# EAGLE design Mega Stepper Shield Integrated (EAGLE 9.6.2)

## Sheet 1 of 2
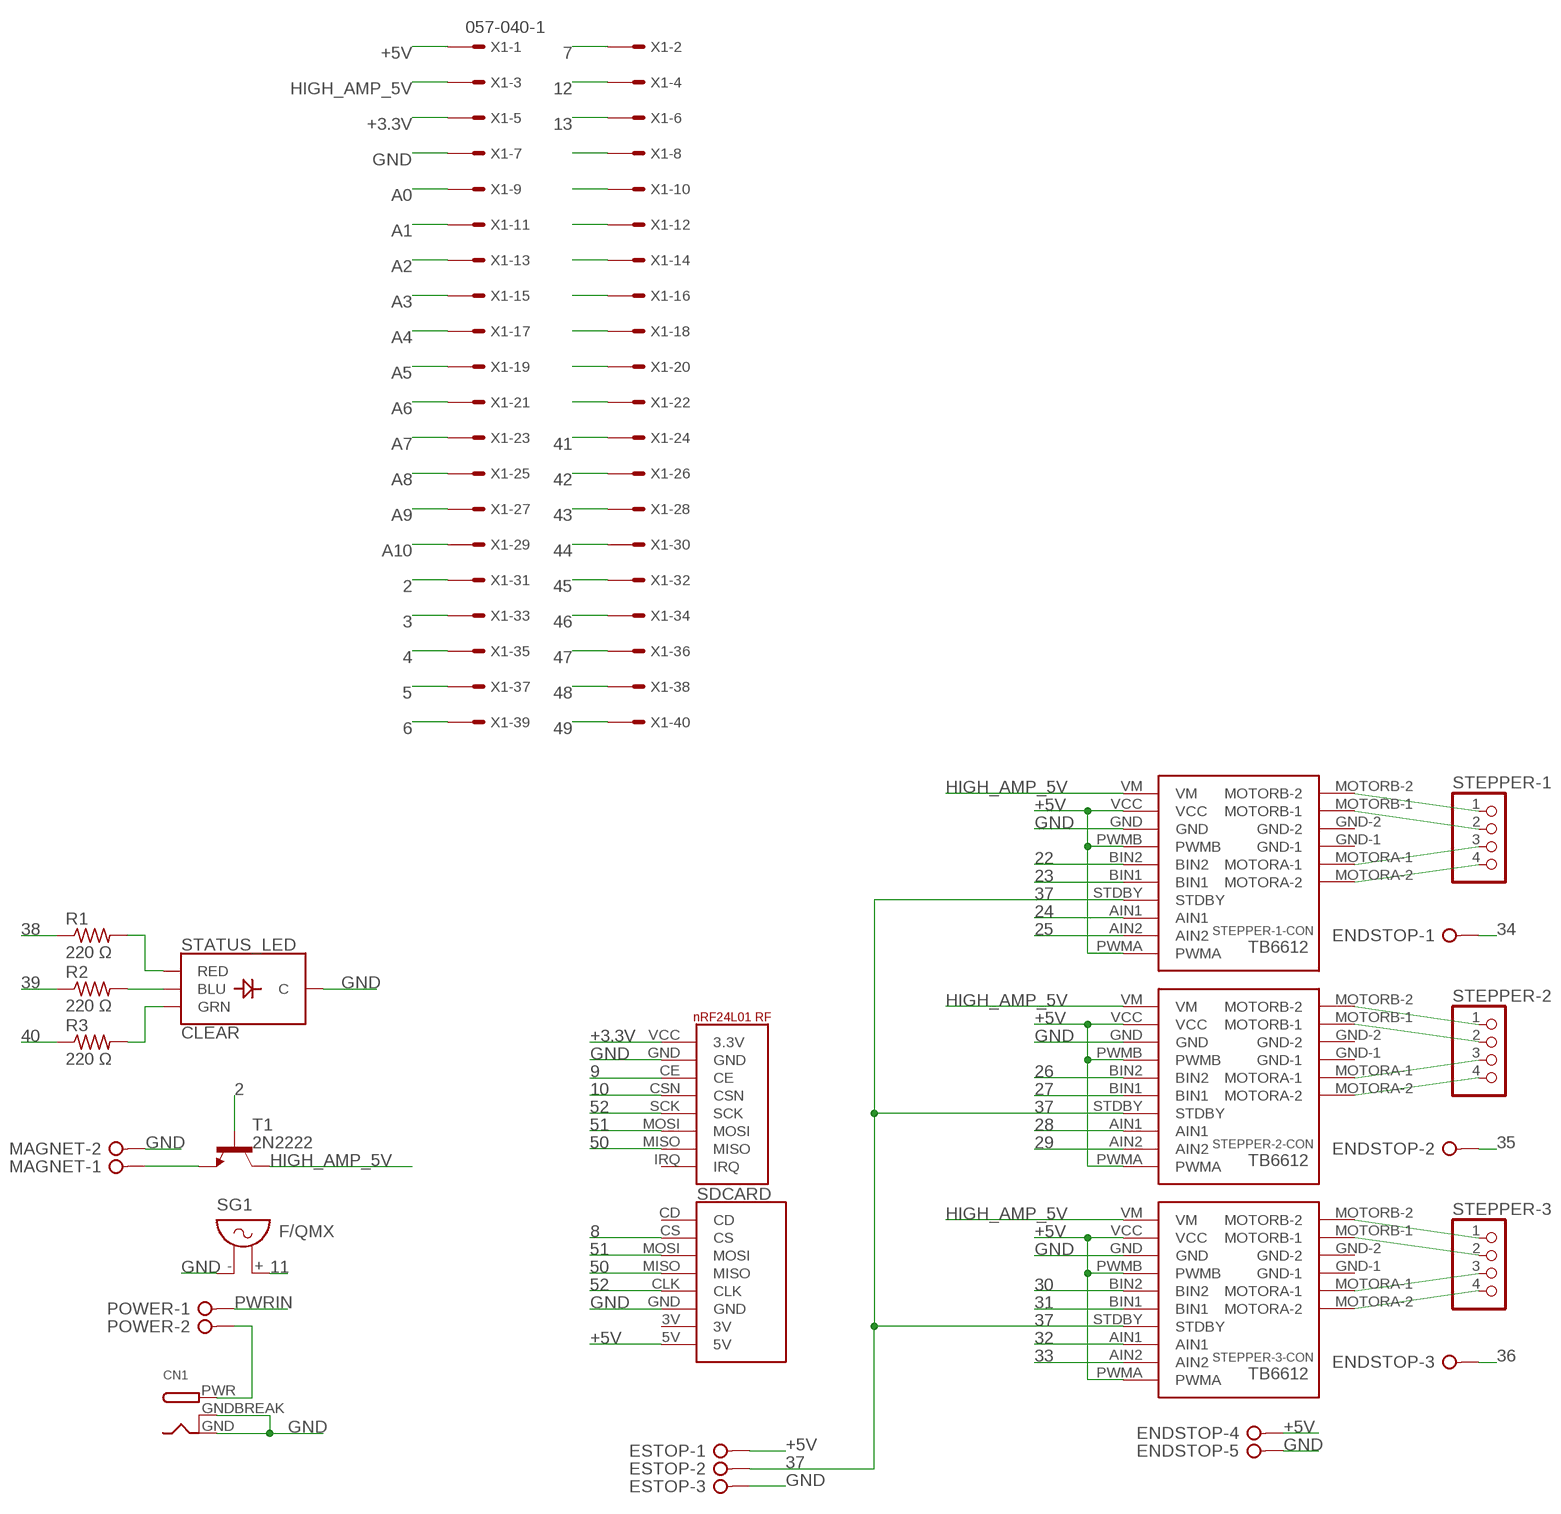
[diagram p0: schematic, sheet 1]

### Parts
CN1  DCBARRELPTH  [DCJACK_2MM_PTH]
ENDSTOP  W237-05P  [W237-5P]
ESTOP  W237-3E  [W237-3E]
MAGNET  W237-02P  [W237-132]
POWER  W237-02P  [W237-132]
R1  220 Ω  R-US_0204/7  [0204/7]
R2  220 Ω  R-US_0204/7  [0204/7]
R3  220 Ω  R-US_0204/7  [0204/7]
SDCARD  MICRO_SD_BREAKOUT  [MICROSDCARDBREAKOUT]
SG1  F/QMX  [F/QMX]
STATUS_LED  CLEAR  LED-RGB-CCCLEAR  [LED-RGB-THRU]
STEPPER-1  PINHD-1X4  [1X04]
STEPPER-1-CON  TB6612-BREAKOUT-MOTOR-CONTROLLER  [TB6612-HEADERS]
STEPPER-2  PINHD-1X4  [1X04]
STEPPER-2-CON  TB6612-BREAKOUT-MOTOR-CONTROLLER  [TB6612-HEADERS]
STEPPER-3  PINHD-1X4  [1X04]
STEPPER-3-CON  TB6612-BREAKOUT-MOTOR-CONTROLLER  [TB6612-HEADERS]
T1  2N2222  [TO92-EBC-OVAL]
U$1  NRF24L01_RF_MODULE  [NRF24L01RF]
X1  057-040-1  [057-040-1]

### Nets
2: T1.B X1.31 ; also sheet 2
3: X1.33 ; also sheet 2
4: X1.35 ; also sheet 2
5: X1.37 ; also sheet 2
6: X1.39 ; also sheet 2
7: X1.2 ; also sheet 2
8: SDCARD.CS ; also sheet 2
9: U$1.CE ; also sheet 2
10: U$1.CSN ; also sheet 2
11: SG1.+ ; also sheet 2
12: X1.4 ; also sheet 2
13: X1.6 ; also sheet 2
16: X1.8
22: STEPPER-1-CON.BIN2 ; also sheet 2
23: STEPPER-1-CON.BIN1 ; also sheet 2
24: STEPPER-1-CON.AIN1 ; also sheet 2
25: STEPPER-1-CON.AIN2 ; also sheet 2
26: STEPPER-2-CON.BIN2 ; also sheet 2
27: STEPPER-2-CON.BIN1 ; also sheet 2
28: STEPPER-2-CON.AIN1 ; also sheet 2
29: STEPPER-2-CON.AIN2 ; also sheet 2
30: STEPPER-3-CON.BIN2 ; also sheet 2
31: STEPPER-3-CON.BIN1 ; also sheet 2
32: STEPPER-3-CON.AIN1 ; also sheet 2
33: STEPPER-3-CON.AIN2 ; also sheet 2
34: ENDSTOP.1 ; also sheet 2
35: ENDSTOP.2 ; also sheet 2
36: ENDSTOP.3 ; also sheet 2
37: ESTOP.2 STEPPER-1-CON.STDBY STEPPER-2-CON.STDBY STEPPER-3-CON.STDBY ; also sheet 2
38: R1.1 ; also sheet 2
39: R2.1 ; also sheet 2
40: R3.1 X1.22 ; also sheet 2
41: X1.24 ; also sheet 2
42: X1.26 ; also sheet 2
43: X1.28 ; also sheet 2
44: X1.30 ; also sheet 2
45: X1.32 ; also sheet 2
46: X1.34 ; also sheet 2
47: X1.36 ; also sheet 2
48: X1.38 ; also sheet 2
49: X1.40 ; also sheet 2
50: SDCARD.MISO U$1.MISO ; also sheet 2
51: SDCARD.MOSI U$1.MOSI ; also sheet 2
52: SDCARD.CLK U$1.SCK ; also sheet 2
+3.3V [Power]: U$1.VCC(3.3V) X1.5
+5V: ENDSTOP.4 ESTOP.1 SDCARD.5V STEPPER-1-CON.PWMA STEPPER-1-CON.PWMB STEPPER-1-CON.VCC STEPPER-2-CON.PWMA STEPPER-2-CON.PWMB STEPPER-2-CON.VCC STEPPER-3-CON.PWMA STEPPER-3-CON.PWMB STEPPER-3-CON.VCC X1.1 ; also sheet 2
A0: X1.9 ; also sheet 2
A1: X1.11 ; also sheet 2
A2: X1.13 ; also sheet 2
A3: X1.15 ; also sheet 2
A4: X1.17 ; also sheet 2
A5: X1.19 ; also sheet 2
A6: X1.21 ; also sheet 2
A7: X1.23 ; also sheet 2
A8: X1.25 ; also sheet 2
A9: X1.27 ; also sheet 2
A10: X1.29 ; also sheet 2
GND [Power]: CN1.GND CN1.GNDBREAK ENDSTOP.5 ESTOP.3 MAGNET.2 SDCARD.GND SG1.- STATUS_LED.2(C) STEPPER-1-CON.GND STEPPER-2-CON.GND STEPPER-3-CON.GND U$1.GND X1.7 ; also sheet 2
HIGH_AMP_5V [Power]: STEPPER-1-CON.VM STEPPER-2-CON.VM STEPPER-3-CON.VM T1.C X1.3 ; also sheet 2
N$11 [Power]: CN1.PWR POWER.2
N$15 [Stepper Output]: STEPPER-1-CON.MOTORB-2 STEPPER-1.1
N$16 [Stepper Output]: STEPPER-1-CON.MOTORB-1 STEPPER-1.2
N$17 [Stepper Output]: STEPPER-1-CON.MOTORA-1 STEPPER-1.3
N$18 [Stepper Output]: STEPPER-1-CON.MOTORA-2 STEPPER-1.4
N$19 [Stepper Output]: STEPPER-2-CON.MOTORB-2 STEPPER-2.1
N$20 [Stepper Output]: STEPPER-2-CON.MOTORB-1 STEPPER-2.2
N$21 [Stepper Output]: STEPPER-2-CON.MOTORA-1 STEPPER-2.3
N$22 [Stepper Output]: STEPPER-2-CON.MOTORA-2 STEPPER-2.4
N$23 [Stepper Output]: STEPPER-3-CON.MOTORB-2 STEPPER-3.1
N$24 [Stepper Output]: STEPPER-3-CON.MOTORB-1 STEPPER-3.2
N$25 [Stepper Output]: STEPPER-3-CON.MOTORA-1 STEPPER-3.3
N$26 [Stepper Output]: STEPPER-3-CON.MOTORA-2 STEPPER-3.4
N$28: R3.2 STATUS_LED.3(GRN)
N$29: R2.2 STATUS_LED.4(BLU)
N$30: R1.2 STATUS_LED.1(RED)
N$42 [Power]: MAGNET.1 T1.E
N$44: X1.10
N$45: X1.12
N$46: X1.14
N$47: X1.16
N$48: X1.18
N$49: X1.20
PWRIN [Power]: POWER.1 ; also sheet 2
Unconnected: SDCARD.3V SDCARD.CD STEPPER-1-CON.GND-1 STEPPER-1-CON.GND-2 STEPPER-2-CON.GND-1 STEPPER-2-CON.GND-2 STEPPER-3-CON.GND-1 STEPPER-3-CON.GND-2 U$1.IRQ

## Sheet 2 of 2
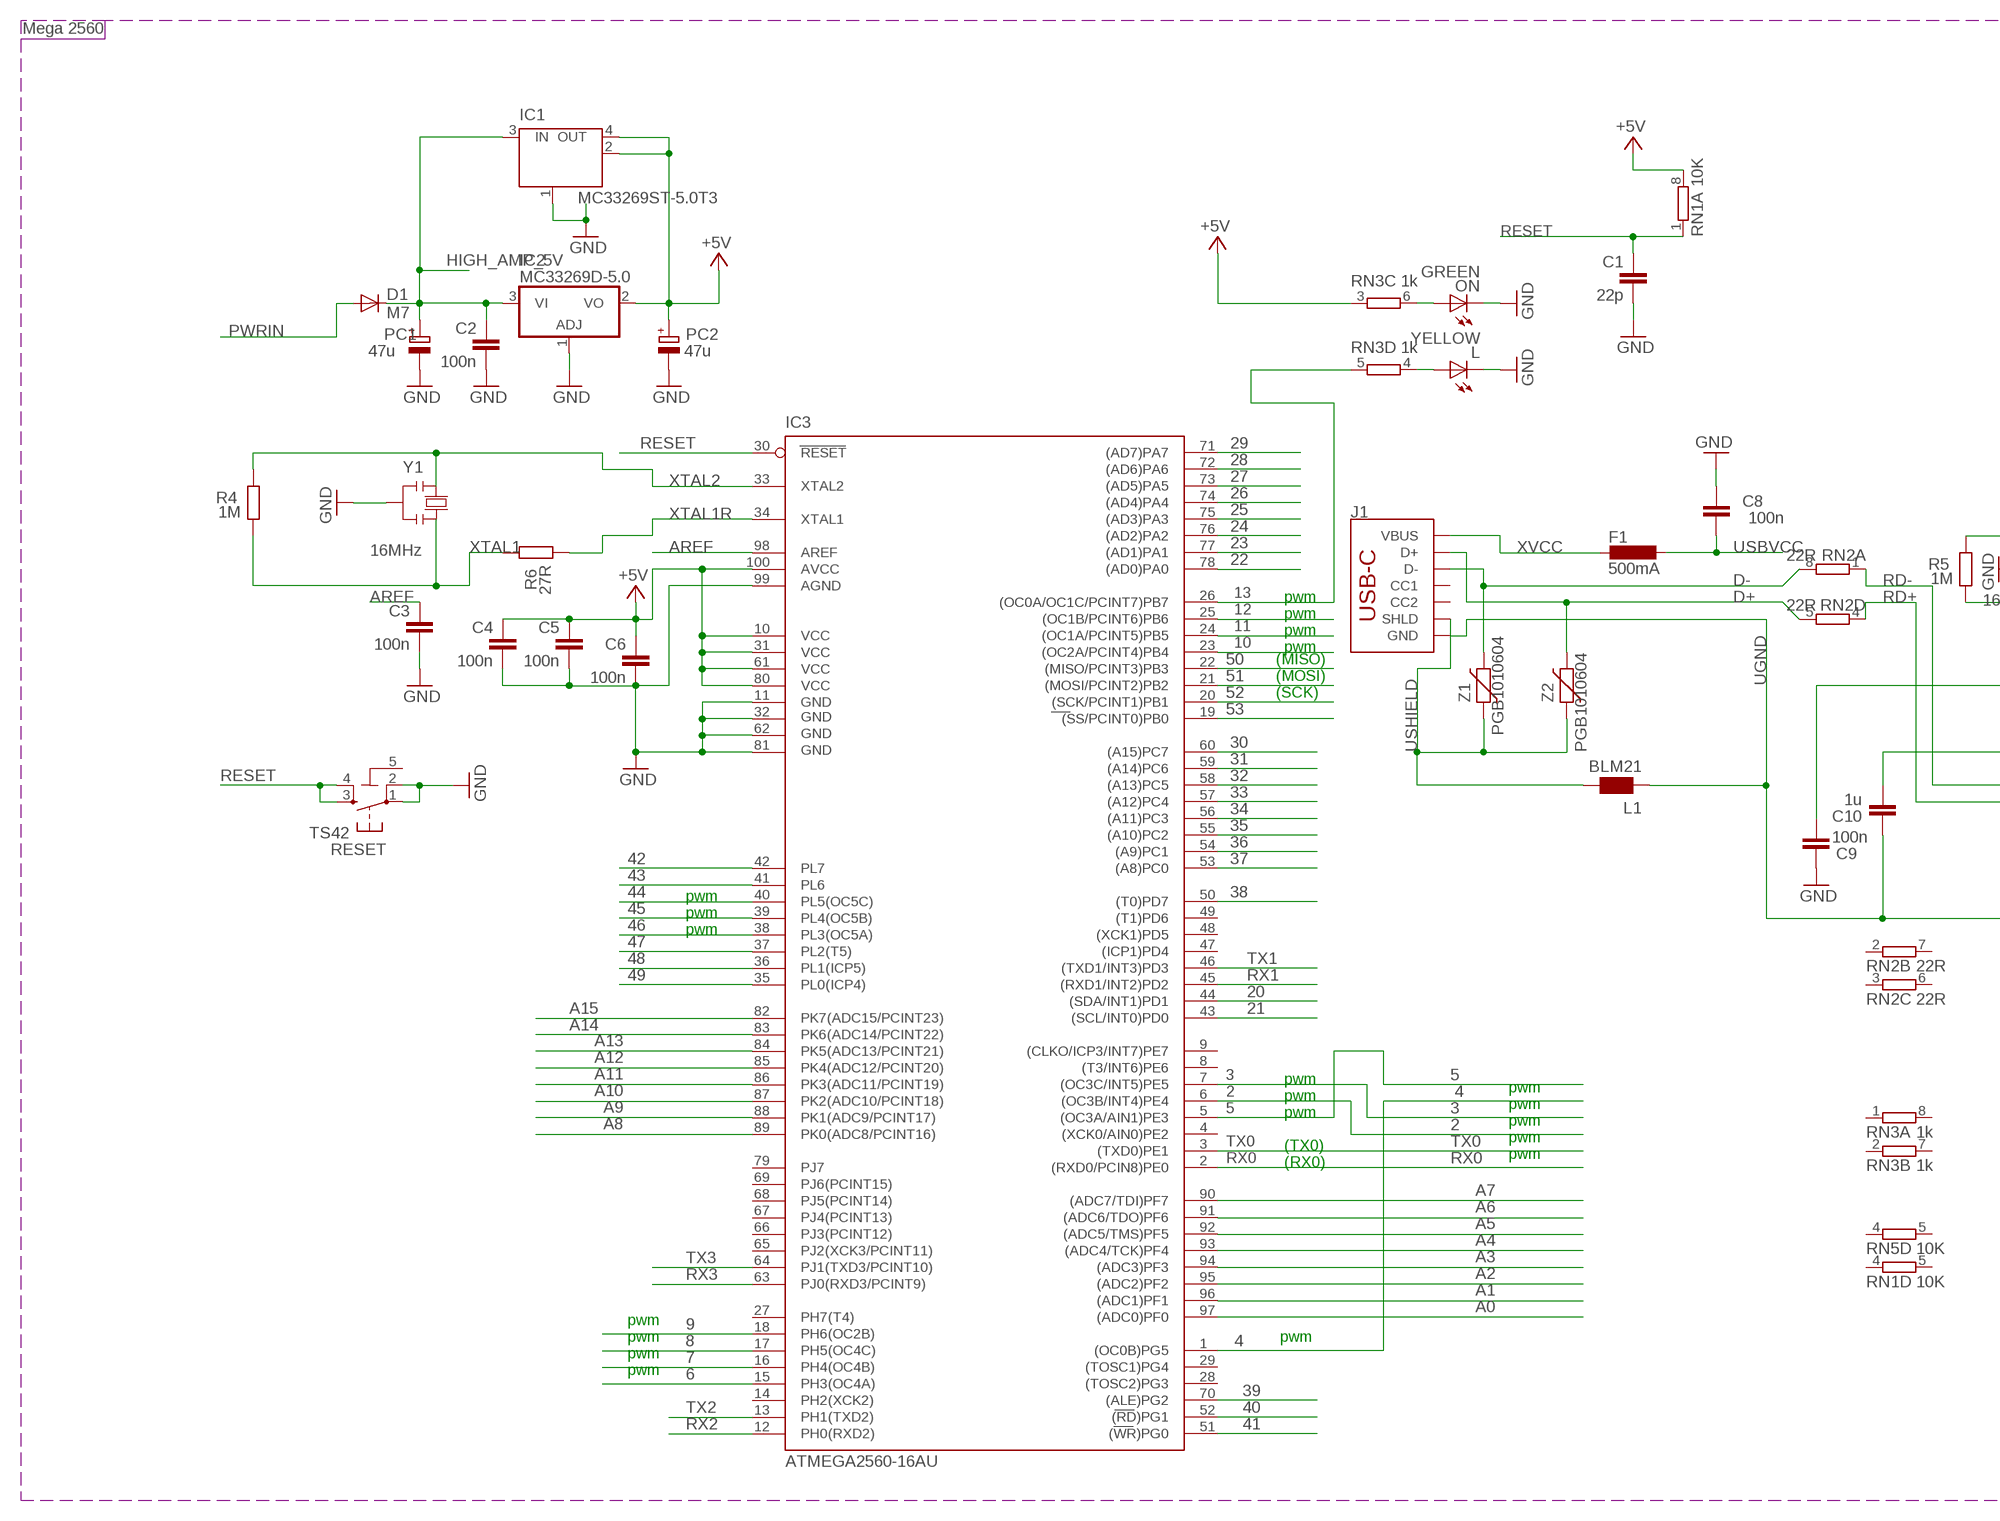
[diagram p1: schematic, sheet 2, part 1 of 2]
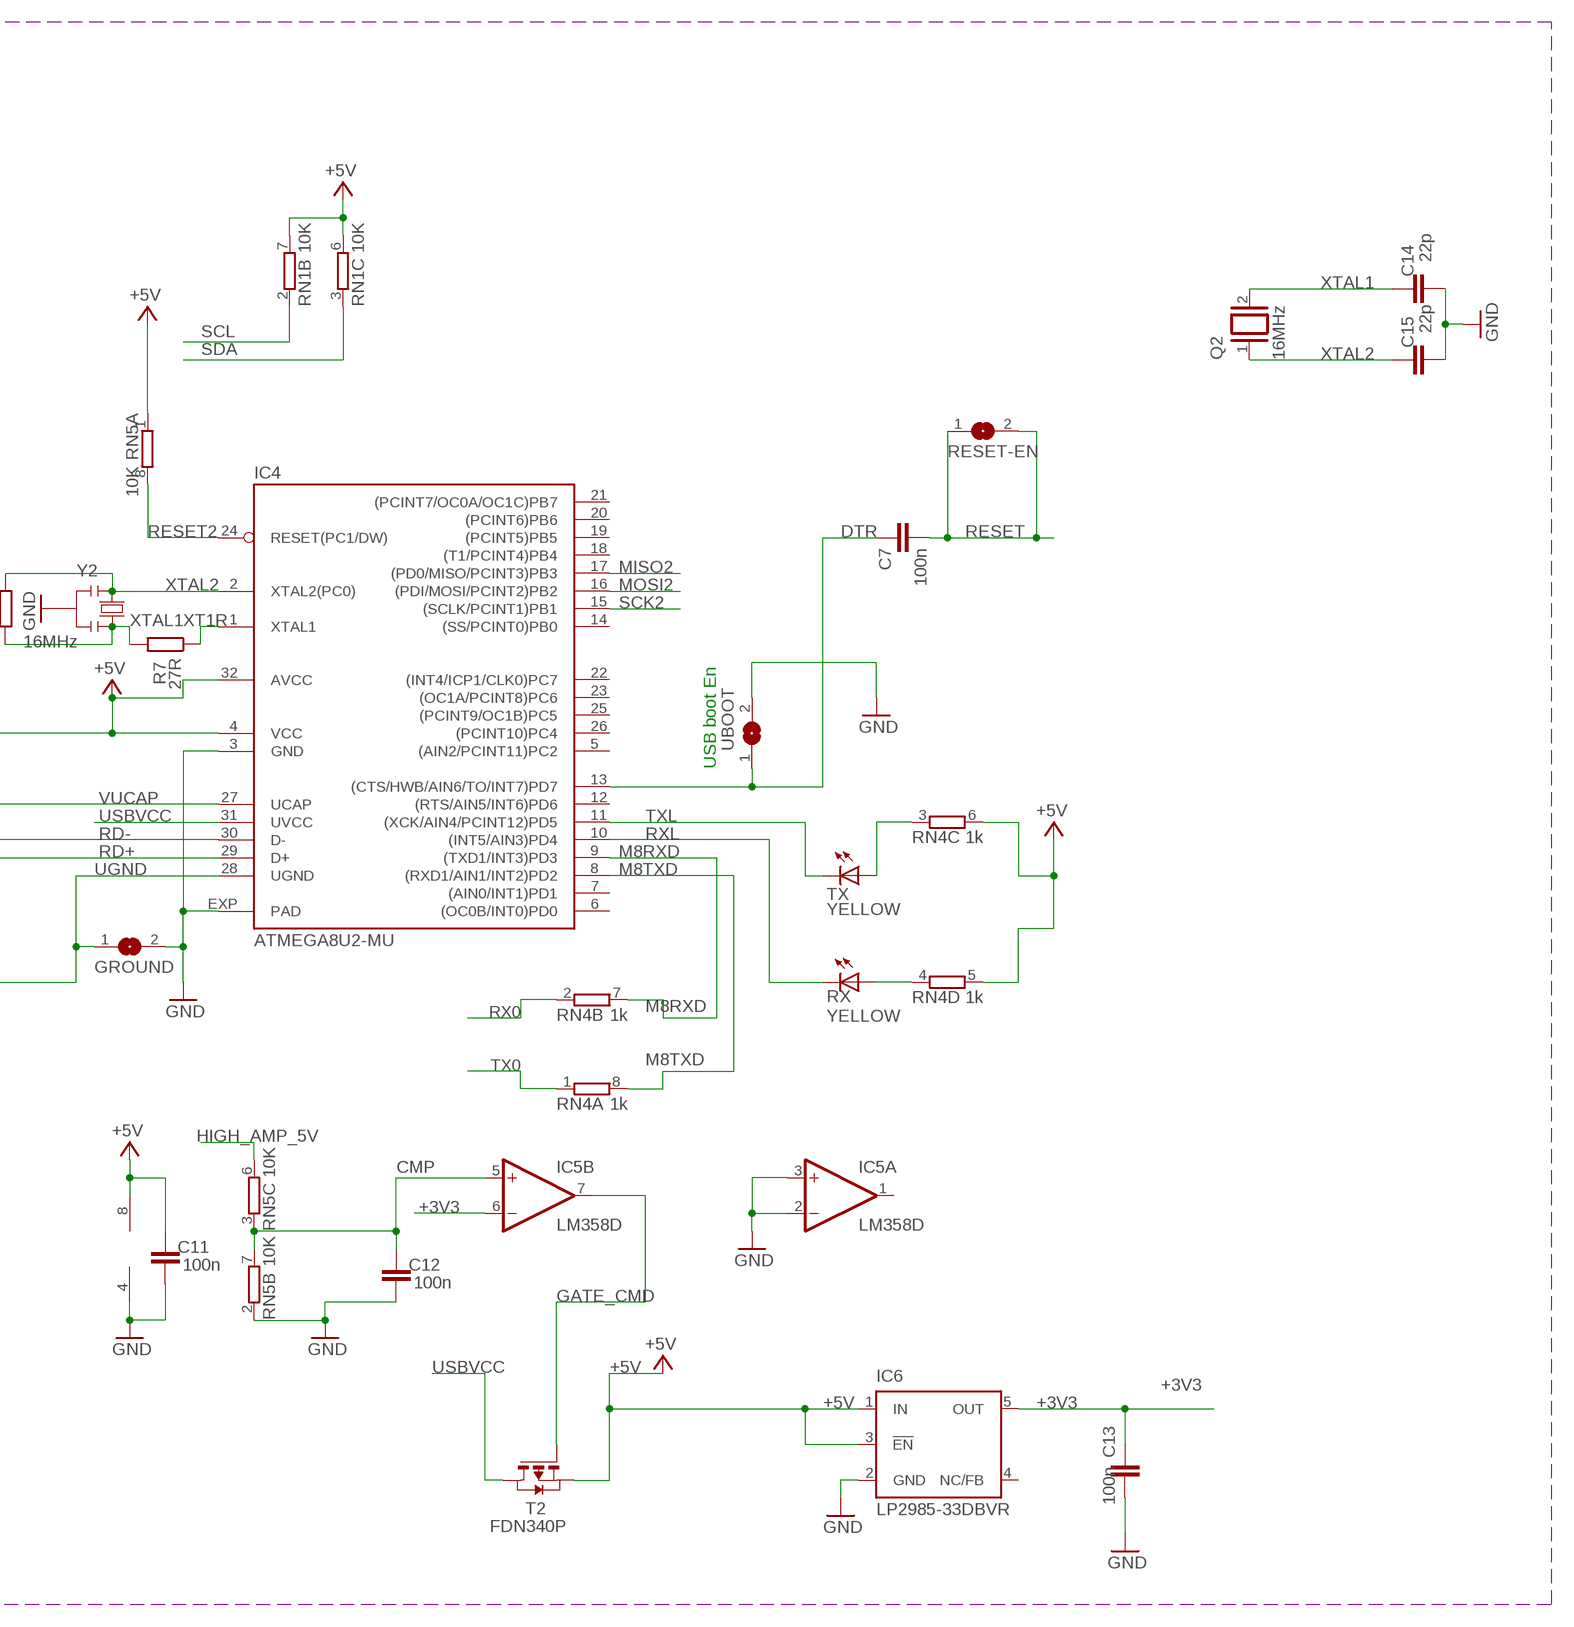
[diagram p2: schematic, sheet 2, part 2 of 2]

### Parts
C1  22p  C-EU0603-RND  [C0603-ROUND]
C2  100n  C-EU0603-RND  [C0603-ROUND]
C3  100n  C-EU0603-RND  [C0603-ROUND]
C4  100n  C-EU0603-RND  [C0603-ROUND]
C5  100n  C-EU0603-RND  [C0603-ROUND]
C6  100n  C-EU0603-RND  [C0603-ROUND]
C7  100n  C-EU0603-RND  [C0603-ROUND]
C8  100n  C-EUC0603  [C0603]
C9  100n  C-EU0603-RND  [C0603-ROUND]
C10  1u  C-EU0603-RND  [C0603-ROUND]
C11  100n  C-EUC0603  [C0603]
C12  100n  C-EU0603-RND  [C0603-ROUND]
C13  100n  C-EU0603-RND  [C0603-ROUND]
C14  22p  C-EU0603-RND  [C0603-ROUND]
C15  22p  C-EU0603-RND  [C0603-ROUND]
D1  M7  DIODE-SMB  [SMB]
F1  500mA  L-EUL1812  [L1812]
GROUND  SJ  [SJ]
IC1  MC33269ST-5.0T3  MC33269ST-3.3T3  [SOT223]
IC2  MC33269D-5.0  [DPACK]
IC3  ATMEGA2560-16AU  ATMEGA1280-16AU  [TQFP100]
IC4  ATMEGA8U2-MU  [QFN32]
IC5  LM358D  [SO08]
IC6  LP2985-33DBVR  TPS77033  [SOT23-DBV]
J1  USB_C_2-LAYER_PADS  [USB-C-16P-2LAYER-PADS]
L  YELLOW  LEDCHIP-LED0805  [CHIP-LED0805]
L1  BLM21  WE-CBF_0805  [0805]
ON  GREEN  LEDCHIP-LED0805  [CHIP-LED0805]
PC1  47u  CPOL-EUD  [PANASONIC_D]
PC2  47u  CPOL-EUD  [PANASONIC_D]
Q2  16MHz  XTAL/S  [QS]
R4  1M  R-EU_R0603  [R0603-ROUND]
R5  1M  R-EU_R0603  [R0603-ROUND]
R6  27R  R-EU_R0603  [R0603-ROUND]
R7  27R  R-EU_R0603  [R0603-ROUND]
RESET  TS42  [TS42]
RESET-EN  SJ  [SJ]
RN1  10K  4R-NCAT16  [CAT16]
RN2  22R  4R-NCAY16  [CAY16]
RN3  1k  4R-NCAY16  [CAY16]
RN4  1k  4R-NCAY16  [CAY16]
RN5  10K  4R-NCAT16  [CAT16]
RX  YELLOW  LEDCHIP-LED0805  [CHIP-LED0805]
T2  FDN340P  PMOSSOT23  [SOT-23]
TX  YELLOW  LEDCHIP-LED0805  [CHIP-LED0805]
UBOOT  SJ  [SJ]
Y1  16MHz  RESONATORMU  [RESONATOR]
Y2  16MHz  RESONATORMU  [RESONATOR]
Z1  PGB1010604  VARISTORCN0603  [CT/CN0603]
Z2  PGB1010604  VARISTORCN0603  [CT/CN0603]

### Nets
2: IC3.6((OC3B/INT4)PE4) ; also sheet 1
3: IC3.7((OC3C/INT5)PE5) ; also sheet 1
4: IC3.1((OC0B)PG5) ; also sheet 1
5: IC3.5((OC3A/AIN1)PE3) ; also sheet 1
6: IC3.15(PH3(OC4A)) ; also sheet 1
7: IC3.16(PH4(OC4B)) ; also sheet 1
8: IC3.17(PH5(OC4C)) ; also sheet 1
9: IC3.18(PH6(OC2B)) ; also sheet 1
10: IC3.23((OC2A/PCINT4)PB4) ; also sheet 1
11: IC3.24((OC1A/PCINT5)PB5) ; also sheet 1
12: IC3.25((OC1B/PCINT6)PB6) ; also sheet 1
13: IC3.26((OC0A/OC1C/PCINT7)PB7) RN3.5 ; also sheet 1
20: IC3.44((SDA/INT1)PD1)
21: IC3.43((SCL/INT0)PD0)
22: IC3.78((AD0)PA0) ; also sheet 1
23: IC3.77((AD1)PA1) ; also sheet 1
24: IC3.76((AD2)PA2) ; also sheet 1
25: IC3.75((AD3)PA3) ; also sheet 1
26: IC3.74((AD4)PA4) ; also sheet 1
27: IC3.73((AD5)PA5) ; also sheet 1
28: IC3.72((AD6)PA6) ; also sheet 1
29: IC3.71((AD7)PA7) ; also sheet 1
30: IC3.60((A15)PC7) ; also sheet 1
31: IC3.59((A14)PC6) ; also sheet 1
32: IC3.58((A13)PC5) ; also sheet 1
33: IC3.57((A12)PC4) ; also sheet 1
34: IC3.56((A11)PC3) ; also sheet 1
35: IC3.55((A10)PC2) ; also sheet 1
36: IC3.54((A9)PC1) ; also sheet 1
37: IC3.53((A8)PC0) ; also sheet 1
38: IC3.50((T0)PD7) ; also sheet 1
39: IC3.70((ALE)PG2) ; also sheet 1
40: IC3.52((RD)PG1) ; also sheet 1
41: IC3.51((WR)PG0) ; also sheet 1
42: IC3.42(PL7) ; also sheet 1
43: IC3.41(PL6) ; also sheet 1
44: IC3.40(PL5(OC5C)) ; also sheet 1
45: IC3.39(PL4(OC5B)) ; also sheet 1
46: IC3.38(PL3(OC5A)) ; also sheet 1
47: IC3.37(PL2(T5)) ; also sheet 1
48: IC3.36(PL1(ICP5)) ; also sheet 1
49: IC3.35(PL0(ICP4)) ; also sheet 1
50: IC3.22((MISO/PCINT3)PB3) ; also sheet 1
51: IC3.21((MOSI/PCINT2)PB2) ; also sheet 1
52: IC3.20((SCK/PCINT1)PB1) ; also sheet 1
53: IC3.19((SS/PCINT0)PB0)
+3V3: C13.2 IC5.6(B:-IN) IC6.5(OUT)
+5V: C4.1 C5.1 C6.1 C9.1 C11.2 IC1.2(OUT) IC1.4(OUT) IC2.2(VO) IC3.10(VCC) IC3.31(VCC1) IC3.61(VCC2) IC3.80(VCC3) IC3.100(AVCC) IC4.4(VCC) IC4.32(AVCC) IC5.8(P:V+) IC6.1(IN) IC6.3(!EN) PC2.+ RN1.6 RN1.7 RN1.8 RN3.3 RN4.5 RN4.6 RN5.1 T2.2(S) ; also sheet 1
A0: IC3.97((ADC0)PF0) ; also sheet 1
A1: IC3.96((ADC1)PF1) ; also sheet 1
A2: IC3.95((ADC2)PF2) ; also sheet 1
A3: IC3.94((ADC3)PF3) ; also sheet 1
A4: IC3.93((ADC4/TCK)PF4) ; also sheet 1
A5: IC3.92((ADC5/TMS)PF5) ; also sheet 1
A6: IC3.91((ADC6/TDO)PF6) ; also sheet 1
A7: IC3.90((ADC7/TDI)PF7) ; also sheet 1
A8: IC3.89(PK0(ADC8/PCINT16)) ; also sheet 1
A9: IC3.88(PK1(ADC9/PCINT17)) ; also sheet 1
A10: IC3.87(PK2(ADC10/PCINT18)) ; also sheet 1
A11: IC3.86(PK3(ADC11/PCINT19))
A12: IC3.85(PK4(ADC12/PCINT20))
A13: IC3.84(PK5(ADC13/PCINT21))
A14: IC3.83(PK6(ADC14/PCINT22))
A15: IC3.82(PK7(ADC15/PCINT23))
AREF: C3.1 IC3.98(AREF)
CMP: C12.2 IC5.5(B:+IN) RN5.3 RN5.7
D+: J1.A6(D+) J1.B6(D+) RN2.5 Z2.2
D-: J1.A7(D-) J1.B7(D-) RN2.8 Z1.2
DTR: C7.1 IC4.13((CTS/HWB/AIN6/TO/INT7)PD7) UBOOT.1
GATE_CMD: IC5.7(B:OUT) T2.3(G)
GND [Power]: C1.2 C2.2 C3.2 C4.2 C5.2 C6.2 C8.2 C9.2 C11.1 C12.1 C13.1 C14.1 C15.1 GROUND.2 IC1.1(GND/ADJ) IC2.1(ADJ) IC3.11(GND) IC3.32(GND1) IC3.62(GND2) IC3.81(GND3) IC3.99(AGND) IC4.3(GND) IC4.EXP(PAD) IC5.2(A:-IN) IC5.3(A:+IN) IC5.4(P:V-) IC6.2(GND) L.C ON.C PC1.- PC2.- RESET.1 RESET.2 RN5.2 UBOOT.2 Y1.2 Y2.2 ; also sheet 1
HIGH_AMP_5V [Power]: C2.1 D1.C IC1.3(IN) IC2.3(VI) PC1.+ RN5.6 ; also sheet 1
M8RXD: IC4.9((TXD1/INT3)PD3) RN4.7
M8TXD: IC4.8((RXD1/AIN1/INT2)PD2) RN4.8
MISO2: IC4.17((PD0/MISO/PCINT3)PB3)
MOSI2: IC4.16((PDI/MOSI/PCINT2)PB2)
N$32: ON.A RN3.6
N$33: L.A RN3.4
N$54: RN4.4 RX.A
N$55: RN4.3 TX.A
PWRIN [Power]: D1.A ; also sheet 1
RD+: IC4.29(D+) RN2.4
RD-: IC4.30(D-) RN2.1
RESET: C1.1 C7.2 IC3.30(RESET) RESET-EN.1 RESET-EN.2 RESET.3 RESET.4 RN1.1
RESET2: IC4.24(RESET(PC1/DW)) RN5.8
RX0: IC3.2((RXD0/PCIN8)PE0) RN4.2
RX1: IC3.45((RXD1/INT2)PD2)
RX2: IC3.12(PH0(RXD2))
RX3: IC3.63(PJ0(RXD3/PCINT9))
RXL: IC4.10((INT5/AIN3)PD4) RX.C
SCK2: IC4.15((SCLK/PCINT1)PB1)
SCL: RN1.2
SDA: RN1.3
TX0: IC3.3((TXD0)PE1) RN4.1
TX1: IC3.46((TXD1/INT3)PD3)
TX2: IC3.13(PH1(TXD2))
TX3: IC3.64(PJ1(TXD3/PCINT10))
TXL: IC4.11((XCK/AIN4/PCINT12)PD5) TX.C
UGND: C10.2 GROUND.1 IC4.28(UGND) J1.GND J1.GND2(GND) L1.1
USBVCC: C8.1 F1.1 IC4.31(UVCC) T2.1(D)
USHIELD: J1.SHLD1(SHLD) J1.SHLD2(SHLD) J1.SHLD3(SHLD) J1.SHLD4(SHLD) L1.2 Z1.1 Z2.1
VUCAP: C10.1 IC4.27(UCAP)
XT1R: IC4.1(XTAL1) R7.1
XTAL1: C14.2 Q2.2 R4.1 R5.1 R6.2 R7.2 Y1.3 Y2.3
XTAL1R: IC3.34(XTAL1) R6.1
XTAL2: C15.2 IC3.33(XTAL2) IC4.2(XTAL2(PC0)) Q2.1 R4.2 R5.2 Y1.1 Y2.1
XVCC: F1.2 J1.VBUS1(VBUS) J1.VBUS2(VBUS)
Unconnected: IC3.4((XCK0/AIN0)PE2) IC3.8((T3/INT6)PE6) IC3.9((CLKO/ICP3/INT7)PE7) IC3.14(PH2(XCK2)) IC3.27(PH7(T4)) IC3.28((TOSC2)PG3) IC3.29((TOSC1)PG4) IC3.47((ICP1)PD4) IC3.48((XCK1)PD5) IC3.49((T1)PD6) IC3.65(PJ2(XCK3/PCINT11)) IC3.66(PJ3(PCINT12)) IC3.67(PJ4(PCINT13)) IC3.68(PJ5(PCINT14)) IC3.69(PJ6(PCINT15)) IC3.79(PJ7) IC4.5((AIN2/PCINT11)PC2) IC4.6((OC0B/INT0)PD0) IC4.7((AIN0/INT1)PD1) IC4.12((RTS/AIN5/INT6)PD6) IC4.14((SS/PCINT0)PB0) IC4.18((T1/PCINT4)PB4) IC4.19((PCINT5)PB5) IC4.20((PCINT6)PB6) IC4.21((PCINT7/OC0A/OC1C)PB7) IC4.22((INT4/ICP1/CLK0)PC7) IC4.23((OC1A/PCINT8)PC6) IC4.25((PCINT9/OC1B)PC5) IC4.26((PCINT10)PC4) IC5.1(A:OUT) IC6.4(NC/FB) J1.A5(CC1) J1.B5(CC2) RN1.4 RN1.5 RN2.2 RN2.3 RN2.6 RN2.7 RN3.1 RN3.2 RN3.7 RN3.8 RN5.4 RN5.5

### Notes on the sheet
- Mega 2560
- pwm
- pwm
- pwm
- pwm
- (MISO)
- (MOSI)
- (SCK)
- USB boot En
- pwm
- pwm
- pwm
- pwm
- pwm
- pwm
- pwm
- pwm
- pwm
- pwm
- (TX0)
- pwm
- (RX0)
- pwm
- pwm | pwm
- pwm
- pwm

## Power pins joined to a net without a drawn wire
5-GND: RESET.5(5-GND)

## Library data of the parts
C1-C7 C9 C10 C12-C15 = SmartPrj:C-EU: CAPACITOR, European symbol
C8 C11 = rcl:C-EU: CAPACITOR, European symbol
CN1 = adafruit:DCBARREL: 2.0mm DC Barrel Jack DCJACK_2MM_PTH - Through Hole Jack (4UConnector: 05537)
D1 = diode:DIODE-: DIODE
ENDSTOP = con-wago-508:W237-05P: WAGO SREW CLAMP; OC_FARNELL: unknown; OC_NEWARK: unknown
ESTOP = con-wago-508:W237-3E: WAGO SREW CLAMP; OC_FARNELL: unknown; OC_NEWARK: unknown
F1 = rcl:L-EU: INDUCTOR, European symbol
GROUND RESET-EN UBOOT = jumper:SJ: SMD solder JUMPER
IC1 = linear:MC33269ST*: Adjustable Output Low Dropout Voltage Regulator 800 mA Source: http://www.onsemi.com/pub/Collateral/MC33269-D.PDF
IC2 = linear:MC33269?*: Adjustable Output Low Dropout Voltage Regulator 800 mA Source: http://www.onsemi.com/pub/Collateral/MC33269-D.PDF
IC3 = atmel-2005:ATMEGA*: MICROCONTROLLER 64/128/256 Kbytes FLASH 4 Kbytes EEPROM 8 Kbytes SRAM 86 General Purpose I/O pins 12-channels16-bit PWM 4 x Serial USARTs 16-channels 10-bit A/D
IC4 = atmel:ATMEGA8U2-MU
IC5 = linear:LM358: OP AMP also LM158; LM258; LM2904 Source: http://cache.national.com/ds/LM/LM158.pdf
IC6 = texas:TPS770*: ULTRALOW-POWER 50-mA LOW-DROPOUT LINEAR REGULATORS 50-mA Low-Dropout Regulator Source: http://focus.ti.com/lit/ds/symlink/tps77001.pdf
J1 = SparkFun-Connectors:USB_C: USB Type C 16Pin Connector Super Speed pins not available on the 16-pin purely SMD connector so this part is best for USB 2.0 implementations. D1 and D2 are tied together enabling D+/- no matter which way the cable is plugged into the connector. The two channel configuration pins (CC1/2) are exposed. These are normally connected to ground via 5.1k resistors but can be reconfigured for high current/high power applications. **4-LAYER BOARD WARNING!!** If designing 4-layer board, make sure to select the variant _4-LAYER-ISOLATED. The linked footprint (USB-C-16-4LAYER-ISOLATED) includes some very necessary cutout polygons in the inner layers (2 and 15). This prevents the PTH mounting shield legs on the USB connector from electrically connecting any other polygons on the inner layers (usually VCC and GND).; PROD_ID: CONN-14122
L ON RX TX = led:LED: LED OSRAM: - CHIPLED LG R971, LG N971, LY N971, LG Q971, LY Q971, LO R971, LY R971 LH N974, LH R974 LS Q976, LO Q976, LY Q976 LO Q996 - Hyper CHIPLED LW Q18S LB Q993, LB Q99A, LB R99A - SideLED LS A670, LO A670, LY A670, LG A670, LP A670 LB A673, LV A673, LT A673, LW A673 LH A674 LY A675 LS A676, LA A676, LO A676, LY A676, LW A676 LS A679, LY A679, LG A679 - Hyper Micro SIDELED® LS Y876, LA Y876, LO Y876, LY Y876 LT Y87S - SmartLED LW L88C, LW L88S LB L89C, LB L89S, LG L890 LS L89K, LO L89K, LY L89K LS L896, LA L896, LO L896, LY L896 - TOPLED LS T670, LO T670, LY T670, LG T670, LP T670 LSG T670, LSP T670, LSY T670, LOP T670, LYG T670 LG T671, LOG T671, LSG T671 LB T673, LV T673, LT T673, LW T673 LH T674 LS T676, LA T676, LO T676, LY T676, LB T676, LH T676, LSB T676, LW T676 LB T67C, LV T67C, LT T67C, LS T67K, LO T67K, LY T67K, LW E67C LS E67B, LA E67B, LO E67B, LY E67B, LB E67C, LV E67C, LT E67C LW T67C LS T679, LY T679, LG T679 LS T770, LO T770, LY T770, LG T770, LP T770 LB T773, LV T773, LT T773, LW T773 LH T774 LS E675, LA E675, LY E675, LS T675 LS T776, LA T776, LO T776, LY T776, LB T776 LHGB T686 LT T68C, LB T68C - Hyper Mini TOPLED® LB M676 - Mini TOPLED Santana® LG M470 LS M47K, LO M47K, LY M47K Source: http://www.osram.convergy.de LUXEON: - LUMILED® LXK2-PW12-R00, LXK2-PW12-S00, LXK2-PW14-U00, LXK2-PW14-V00 LXK2-PM12-R00, LXK2-PM12-S00, LXK2-PM14-U00 LXK2-PE12-Q00, LXK2-PE12-R00, LXK2-PE12-S00, LXK2-PE14-T00, LXK2-PE14-U00 LXK2-PB12-K00, LXK2-PB12-L00, LXK2-PB12-M00, LXK2-PB14-N00, LXK2-PB14-P00, LXK2-PB14-Q00 LXK2-PR12-L00, LXK2-PR12-M00, LXK2-PR14-Q00, LXK2-PR14-R00 LXK2-PD12-Q00, LXK2-PD12-R00, LXK2-PD12-S00 LXK2-PH12-R00, LXK2-PH12-S00 LXK2-PL12-P00, LXK2-PL12-Q00, LXK2-PL12-R00 Source: www.luxeon.com KINGBRIGHT: KA-3528ASYC Source: www.kingbright.com
L1 = wuerth-elektronik:WE-CBF: SMD EMI Suppression Ferrite Beads - excellent anti-EMI properties - low DCR - impedances till 3000 ohms - rated current up to 6 A
MAGNET POWER = con-wago-508:W237-02P: WAGO SREW CLAMP; OC_FARNELL: unknown; OC_NEWARK: unknown
PC1 PC2 = rcl:CPOL-EU: POLARIZED CAPACITOR, European symbol
Q2 = special:XTAL/S: CRYSTAL
R1-R3 = adafruit:R-US_: RESISTOR, American symbol
R4-R7 = SmartPrj:R-EU_: RESISTOR, European symbol
RESET = st-mod v1.4:TS42: TS42 Dongnan Electronics Tact switch VDC 12V - 50mA
RN1-RN5 = resistor-dil:4R-N: Array Chip Resistor Source: RS Component / Phycomp
SDCARD = SparkFun-Boards-Expanded:MICRO_SD_BREAKOUT: Micro SD Card breakout board, product ID 254 https://www.adafruit.com/product/254
SG1 = buzzer:F/QMX: BUZZER Source: Buerklin; OC_FARNELL: unknown; OC_NEWARK: unknown
STATUS_LED = SparkFun-LED:LED-RGB-CC: LED-RGB Common Cathode Packages: LED RGB-THRU LED_PIRANHA_5MM SparkFun Products: RGB Diffused Common Cathode- Diffuse <[https://www.sparkfun.com/products/9264]> RGB Diffused Common Cathode - Clear <[https://www.sparkfun.com/products/105]> LED-RGB 5mm Square (Piranha) <[https://www.sparkfun.com/products/11679]>; PROD_ID: DIO-08418
STEPPER-1-STEPPER-3 = pinhead:PINHD-1X4: PIN HEADER
STEPPER-1-CON STEPPER-2-CON STEPPER-3-CON = SparkFun-Boards-Expanded:TB6612-BREAKOUT-MOTOR-CONTROLLER: TB6612 breakout headers
T1 = adafruit:2N2222: NPN TRANSISTOR Big oval pads
T2 = zetex:PMOSSOT23: MOS FET
U$1 = SparkFun-Boards-Expanded:NRF24L01_RF_MODULE: Basic RF module
X1 = con-panduit:057-040-: CONNECTOR 40-pin series 057 contact pc board low profile headers; OC_FARNELL: unknown; OC_NEWARK: unknown
Y1 Y2 = SmartPrj:RESONATOR
Z1 Z2 = varistor:VARISTOR: VARISTOR

## Net classes
0 Signal: width 0.178 mm
1 Power: width 1.27 mm
2 Stepper Output: width 0.508 mm

## Board
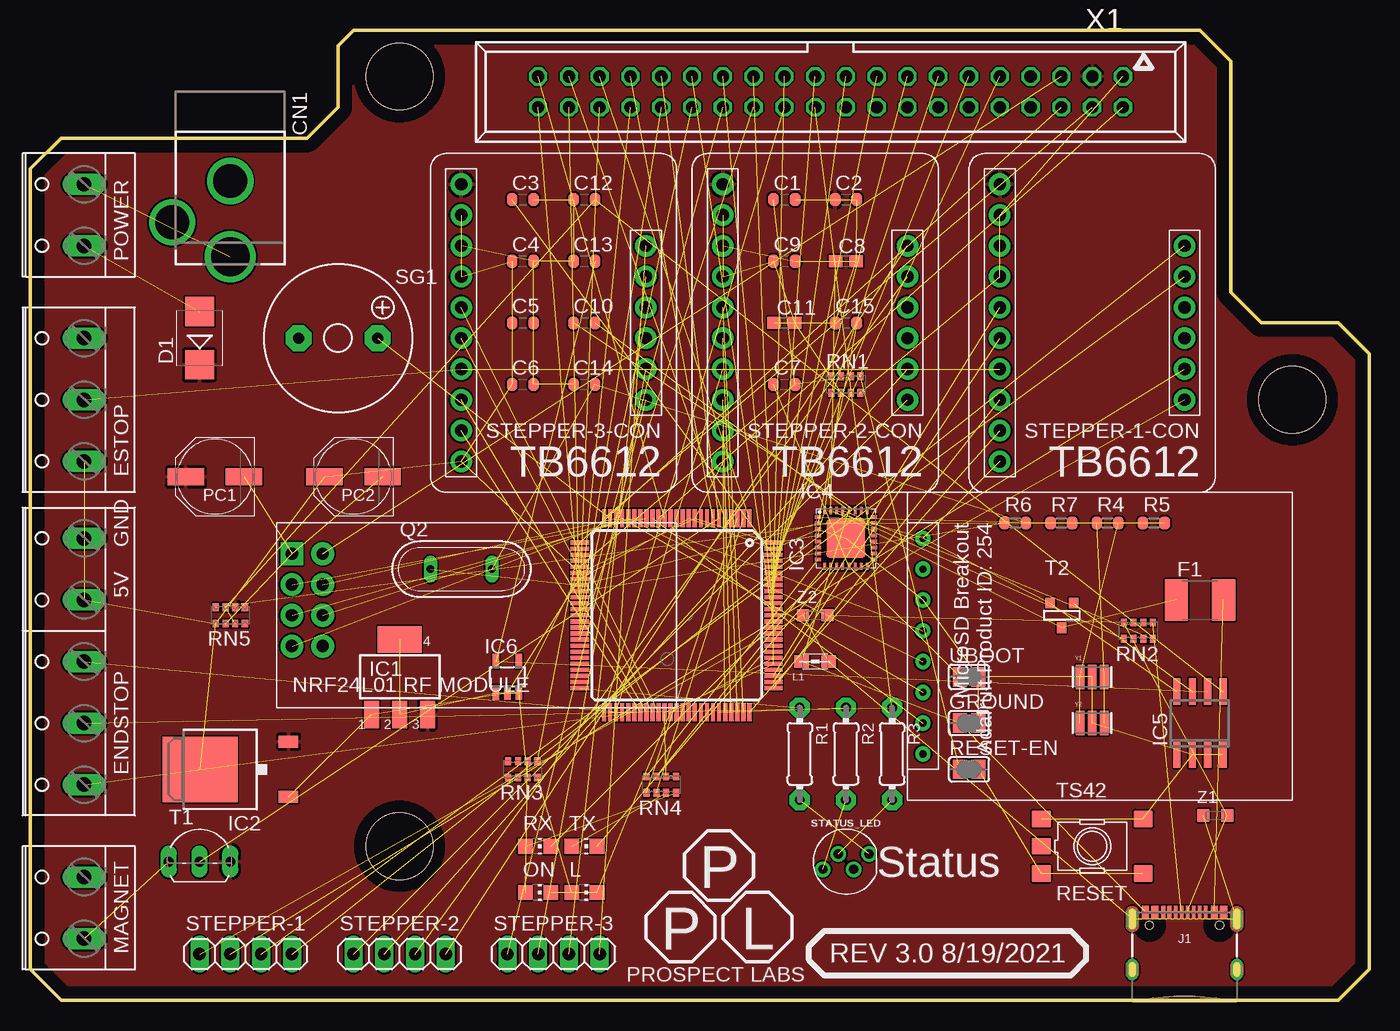
[diagram p3: board, top side]
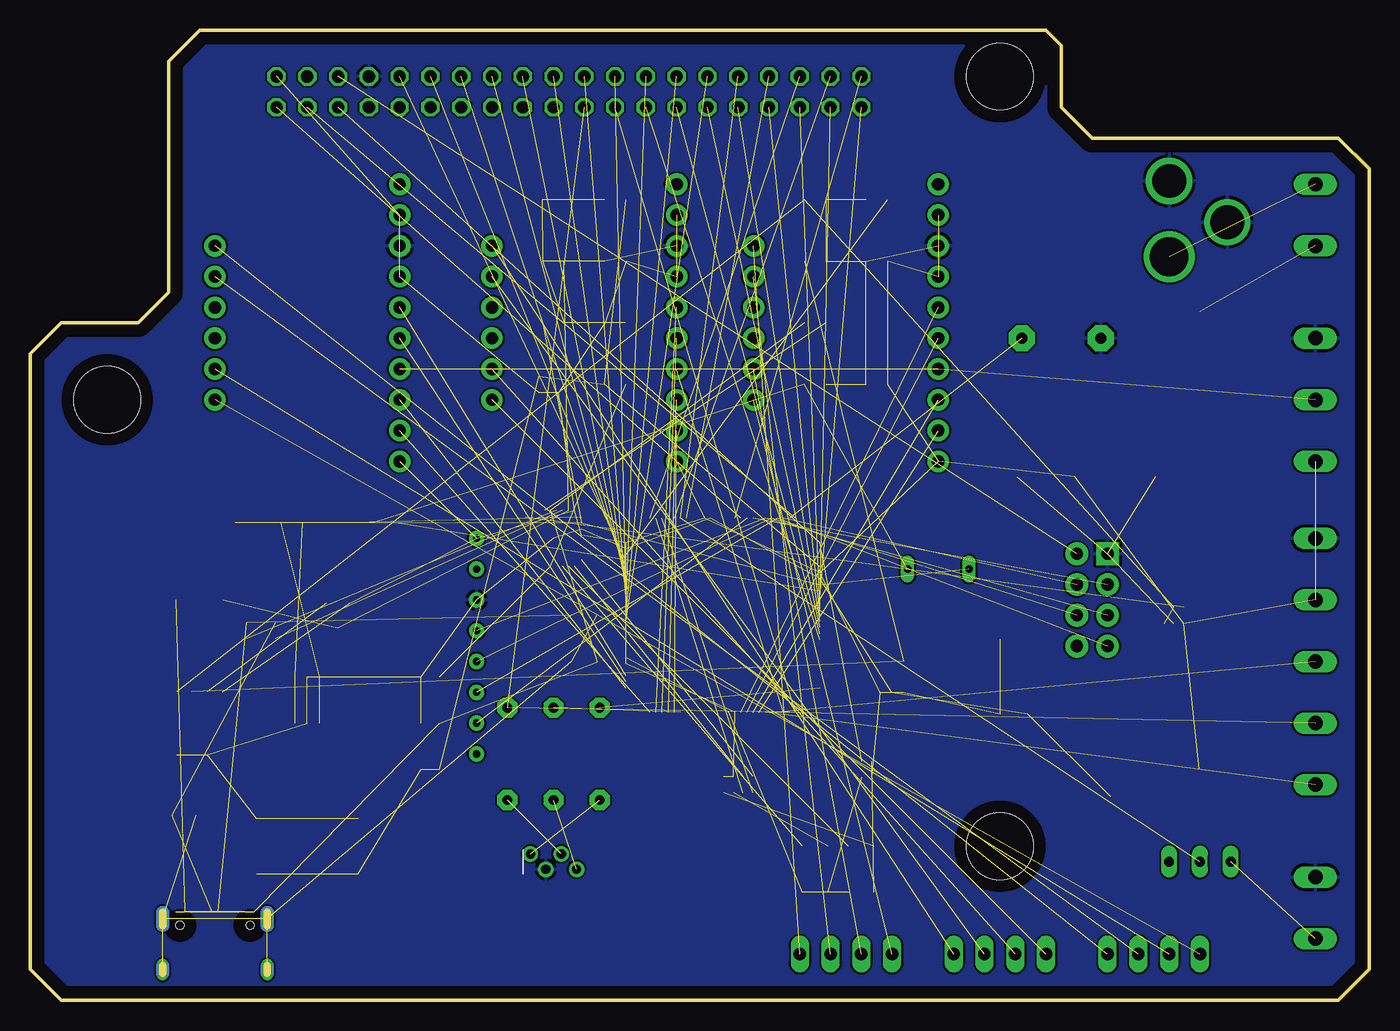
[diagram p4: board, bottom side, seen from below]

Size 110.49 x 80.01 mm. Coordinates in mm from the lower left corner, seen from the top.
Outline: 0,2.54 0,68.58 2.54,71.12 22.86,71.12 25.4,73.66 25.4,78.74 26.67,80.01 96.52,80.01 99.06,77.47 99.06,58.42 101.6,55.88 107.95,55.88 110.49,53.34 110.49,2.54 107.95,0 2.54,0 0,2.54
Copper layers (1*16): Top 0.035mm / dielectric 1.5mm / Bottom 0.035mm
Design rules "default": minimum track width 6mil, minimum drill 0.35mm, track to track 6mil, track to pad 6mil, pad to pad 6mil, via to via 6mil, smd to smd 6mil, copper to edge 40mil, drill to drill 6mil, minimum pad ring 10mil, minimum via ring 8mil, stop-mask expansion 4mil, vias tented up to drill 0mil, thermal gap 10mil
Holes 5.5 mm at 30.48,12.7 104.14,49.53 30.48,76.2
vRestrict: area 49.5,1.3 to 63.5,15.2; area 64.3,1.4 to 87.1,6.5; area 26.4,8.6 to 34.5,16.8; area 100.1,45.5 to 108.2,53.6; area 26.4,72.1 to 34.5,80.3

### Footprints (pad centres in the part's own frame; a part is rotated, then mirrored left to right if it is on the bottom)
C0603-ROUND = smd 0.898 x 1.1: 1 -0.889,0; 2 0.889,0
C0603 = smd 1.1 x 1: 1 -0.85,0; 2 0.85,0
DCJACK_2MM_PTH = drill 2.8: GND 0,7.35; GNDBREAK 4.8,10.75 | drill 3.2: PWR 0,13.6
SMB = smd 2.4 x 2.4: A 2.2,0; C -2.2,0
W237-5P = drill 1.194 long: 1 -10.16,-0.635; 2 -5.08,-0.635; 3 0,-0.635; 4 5.08,-0.635; 5 10.16,-0.635
W237-3E = drill 1.194 long: 1 -5.08,-0.635; 2 0,-0.635; 3 5.08,-0.635
L1812 = smd 1.9 x 3.4: 1 -1.95,0; 2 1.95,0
SJ = smd 1.168 x 1.6: 1 -0.762,0; 2 0.762,0
SOT223 = smd 1.219 x 2.235: 1 -2.311,-3.099; 2 0,-3.099; 3 2.311,-3.099 | smd 3.6 x 2.2: 4 0,3.099
DPACK = smd 1 x 1.6: 1 -2.28,-4.8; 3 2.28,-4.8 | smd 5.4 x 6.2: 2 0,2.5
TQFP100 = smd 1.5 x 0.35: 1 -8,6; 2 -8,5.5; 3 -8,5; 4 -8,4.5; 5 -8,4; 6 -8,3.5; 7 -8,3; 8 -8,2.5; 9 -8,2; 10 -8,1.5; 11 -8,1; 12 -8,0.5; 13 -8,0; 14 -8,-0.5; 15 -8,-1; 16 -8,-1.5; 17 -8,-2; 18 -8,-2.5; 19 -8,-3; 20 -8,-3.5; 21 -8,-4; 22 -8,-4.5; 23 -8,-5; 24 -8,-5.5; 25 -8,-6; 51 8,-6; 52 8,-5.5; 53 8,-5; 54 8,-4.5; 55 8,-4; 56 8,-3.5; 57 8,-3; 58 8,-2.5; 59 8,-2; 60 8,-1.5; 61 8,-1; 62 8,-0.5; 63 8,0; 64 8,0.5; 65 8,1; 66 8,1.5; 67 8,2; 68 8,2.5; 69 8,3; 70 8,3.5; 71 8,4; 72 8,4.5; 73 8,5; 74 8,5.5; 75 8,6 | smd 0.35 x 1.5: 26 -6,-8; 27 -5.5,-8; 28 -5,-8; 29 -4.5,-8; 30 -4,-8; 31 -3.5,-8; 32 -3,-8; 33 -2.5,-8; 34 -2,-8; 35 -1.5,-8; 36 -1,-8; 37 -0.5,-8; 38 0,-8; 39 0.5,-8; 40 1,-8; 41 1.5,-8; 42 2,-8; 43 2.5,-8; 44 3,-8; 45 3.5,-8; 46 4,-8; 47 4.5,-8; 48 5,-8; 49 5.5,-8; 50 6,-8; 76 6,8; 77 5.5,8; 78 5,8; 79 4.5,8; 80 4,8; 81 3.5,8; 82 3,8; 83 2.5,8; 84 2,8; 85 1.5,8; 86 1,8; 87 0.5,8; 88 0,8; 89 -0.5,8; 90 -1,8; 91 -1.5,8; 92 -2,8; 93 -2.5,8; 94 -3,8; 95 -3.5,8; 96 -4,8; 97 -4.5,8; 98 -5,8; 99 -5.5,8; 100 -6,8
QFN32 = smd 0.6 x 0.3: 1 -2.3,1.75; 2 -2.3,1.25; 3 -2.3,0.75; 4 -2.3,0.25; 5 -2.3,-0.25; 6 -2.3,-0.75; 7 -2.3,-1.25; 8 -2.3,-1.75; 17 2.3,-1.75; 18 2.3,-1.25; 19 2.3,-0.75; 20 2.3,-0.25; 21 2.3,0.25; 22 2.3,0.75; 23 2.3,1.25; 24 2.3,1.75 | smd 0.3 x 0.6: 9 -1.75,-2.3; 10 -1.25,-2.3; 11 -0.75,-2.3; 12 -0.25,-2.3; 13 0.25,-2.3; 14 0.75,-2.3; 15 1.25,-2.3; 16 1.75,-2.3; 25 1.75,2.3; 26 1.25,2.3; 27 0.75,2.3; 28 0.25,2.3; 29 -0.25,2.3; 30 -0.75,2.3; 31 -1.25,2.3; 32 -1.75,2.3 | smd 3.2 x 3.2: EXP 0,0
SO08 = smd 0.6 x 2.2: 1 -1.905,-2.6; 2 -0.635,-2.6; 3 0.635,-2.6; 4 1.905,-2.6; 5 1.905,2.6; 6 0.635,2.6; 7 -0.635,2.6; 8 -1.905,2.6
SOT23-DBV = smd 0.55 x 1.2: 1 -0.95,-1.3; 2 0,-1.3; 3 0.95,-1.3; 4 0.95,1.3; 5 -0.95,1.3
USB-C-16P-2LAYER-PADS = smd 0.3 x 1: A5 -1.25,-0.34; A6 -0.25,-0.34; A7 0.25,-0.34; A8 1.25,-0.34; B5 1.75,-0.34; B6 0.75,-0.34; B7 -0.75,-0.34; B8 -1.75,-0.34 | smd 0.6 x 1: GND -3.225,-0.34; GND2 3.225,-0.34; VBUS1 -2.45,-0.34; VBUS2 2.45,-0.34 | drill 0.4 pad 0.6 long: SHLD1 -4.318,-0.915; SHLD2 4.318,-0.915; SHLD3 -4.318,-5.095; SHLD4 4.318,-5.095 | hole 0.65: -2.89,-1.445; 2.89,-1.445
CHIP-LED0805 = smd 1.2 x 1.2: A 0,-1.05; C 0,1.05
0805 = smd 1.2 x 1: 1 -1.1,0; 2 1.1,0
W237-132 = drill 1.194 long: 1 -2.54,-0.635; 2 2.54,-0.635
PANASONIC_D = smd 3 x 1.4: + 2.4,0; - -2.4,0
QS = drill 0.61 long: 1 -2.54,0; 2 2.54,0
0204/7 = drill 0.813 pad 1.676 octagon: 1 -3.81,0; 2 3.81,0
R0603-ROUND = smd 0.898 x 1.1: 1 -0.889,0; 2 0.889,0
TS42 = smd 1.6 x 1.4: 1 -4.2,2.25; 2 4.2,2.25; 3 -4.2,-2.25; 4 4.2,-2.25; 5 -4.2,0
CAT16 = smd 0.5 x 0.65: 1 -1.2,-0.675; 2 -0.4,-0.675; 3 0.4,-0.675; 4 1.2,-0.675; 5 1.2,0.675; 6 0.4,0.675; 7 -0.4,0.675; 8 -1.2,0.675
CAY16 = smd 0.5 x 0.65: 1 -1.2,-0.675; 2 -0.4,-0.675; 3 0.4,-0.675; 4 1.2,-0.675; 5 1.2,0.675; 6 0.4,0.675; 7 -0.4,0.675; 8 -1.2,0.675
MICROSDCARDBREAKOUT = drill 0.6 pad 1.27: 3V 5.08,-6.35; 5V 5.08,-8.89; CD 5.08,8.89; CLK 5.08,-1.27; CS 5.08,6.35; GND 5.08,-3.81; MISO 5.08,3.81; MOSI 5.08,1.27
F/QMX = drill 0.914 pad 2.159 octagon: + 3.251,0; - -3.251,0
LED-RGB-THRU = drill 0.762 pad 1.016: 1 1.905,0.635; 2 0.635,-0.635; 3 -0.635,0.635; 4 -1.905,-0.635
1X04 = drill 1.016 long: 1 -3.81,0; 2 -1.27,0; 3 1.27,0; 4 3.81,0
TB6612-HEADERS = drill 1.016 pad 1.778: AIN1 -7.62,-6.35; AIN2 -7.62,-8.89; BIN1 -7.62,-1.27; BIN2 -7.62,1.27; GND -7.62,6.35; GND-1 7.62,-1.27; GND-2 7.62,1.27; MOTORA-1 7.62,-3.81; MOTORA-2 7.62,-6.35; MOTORB-1 7.62,3.81; MOTORB-2 7.62,6.35; PWMA -7.62,-11.43; PWMB -7.62,3.81; STDBY -7.62,-3.81; VCC -7.62,8.89; VM -7.62,11.43
TO92-EBC-OVAL = drill 0.813 long: B 0,-1.27; C 2.54,-1.27; E -2.54,-1.27
SOT-23 = smd 0.787 x 0.889: 1 0.025,-1.016; 2 -0.94,1.016; 3 0.991,1.016
NRF24L01RF = drill 1.016 pad 1.88: CE 0,8.89; CSN 2.54,8.89; IRQ 2.54,3.81; MISO 0,3.81; MOSI 2.54,6.35; SCK 0,6.35; VCC 2.54,11.43 | drill 1.016 pad 1.88 square: GND 0,11.43
057-040-1 = drill 1 octagon: 1 -24.13,-1.27; 2 -24.13,1.27; 3 -21.59,-1.27; 4 -21.59,1.27; 5 -19.05,-1.27; 6 -19.05,1.27; 7 -16.51,-1.27; 8 -16.51,1.27; 9 -13.97,-1.27; 10 -13.97,1.27; 11 -11.43,-1.27; 12 -11.43,1.27; 13 -8.89,-1.27; 14 -8.89,1.27; 15 -6.35,-1.27; 16 -6.35,1.27; 17 -3.81,-1.27; 18 -3.81,1.27; 19 -1.27,-1.27; 20 -1.27,1.27; 21 1.27,-1.27; 22 1.27,1.27; 23 3.81,-1.27; 24 3.81,1.27; 25 6.35,-1.27; 26 6.35,1.27; 27 8.89,-1.27; 28 8.89,1.27; 29 11.43,-1.27; 30 11.43,1.27; 31 13.97,-1.27; 32 13.97,1.27; 33 16.51,-1.27; 34 16.51,1.27; 35 19.05,-1.27; 36 19.05,1.27; 37 21.59,-1.27; 38 21.59,1.27; 39 24.13,-1.27; 40 24.13,1.27
RESONATOR = smd 0.7 x 2: 1 -1,0; 2 0,0; 3 1,0
CT/CN0603 = smd 1 x 1: 1 -1,0; 2 1,0

### Placement (x,y rotation side)
C1  62.23,66.04 0 top
C2  67.31,66.04 0 top
C3  40.64,66.04 0 top
C4  40.64,60.96 0 top
C5  40.64,55.88 0 top
C6  40.64,50.8 0 top
C7  62.23,50.8 0 top
C8  67.31,60.96 0 top
C9  62.23,60.96 0 top
C10  45.72,55.88 0 top
C11  62.23,55.88 0 top
C12  45.72,66.04 0 top
C13  45.72,60.96 0 top
C14  45.72,50.8 0 top
C15  67.31,55.88 0 top
CN1  16.51,74.93 180 top
D1  13.97,54.61 90 top
ENDSTOP  3.81,27.94 90 top
ESTOP  3.81,49.53 90 top
F1  96.52,33.02 0 top
GROUND  77.47,22.86 0 top
IC1  30.48,26.67 0 top
IC2  16.51,19.05 90 top
IC3  53.34,31.75 270 top
IC4  67.31,38.1 0 top
IC5  96.52,22.86 0 top
IC6  39.37,26.67 0 top
J1  95.25,7.62 0 top
L  45.72,8.89 270 top
L1  64.77,27.94 0 top
MAGNET  3.81,7.62 90 top
ON  41.91,8.89 270 top
PC1  15.24,43.18 180 top
PC2  26.67,43.18 180 top
POWER  3.81,64.77 90 top
Q2  35.56,35.56 0 top
R1  63.5,20.32 270 top
R2  67.31,20.32 270 top
R3  71.12,20.32 270 top
R4  88.9,39.37 0 top
R5  92.71,39.37 0 top
R6  81.28,39.37 0 top
R7  85.09,39.37 0 top
RESET  87.63,12.7 0 top
RESET-EN  77.47,19.05 0 top
RN1  67.31,50.8 180 top
RN2  91.44,30.48 0 top
RN3  40.64,19.05 0 top
RN4  52.07,17.78 0 top
RN5  16.51,31.75 0 top
RX  41.91,12.7 270 top
SDCARD  78.74,29.21 180 top
SG1  25.4,54.61 0 top
STATUS_LED  67.31,11.43 0 top
STEPPER-1  17.78,3.81 180 top
STEPPER-1-CON  87.63,55.88 0 top
STEPPER-2  30.48,3.81 180 top
STEPPER-2-CON  64.77,55.88 0 top
STEPPER-3  43.18,3.81 180 top
STEPPER-3-CON  43.18,55.88 0 top
T1  13.97,12.7 0 top
T2  85.09,31.75 0 top
TX  45.72,12.7 270 top
U$1  21.59,25.4 0 top
UBOOT  77.47,26.67 0 top
X1  66.04,74.93 180 top
Y1  87.63,26.67 0 top
Y2  87.63,22.86 0 top
Z1  97.79,15.24 0 top
Z2  64.77,31.75 0 top

### Tracks (layer width: path | path; a pad name or v marks a point on that pad's centre or on a via)
2  (2 unrouted)
3  (1 unrouted)
4  (1 unrouted)
5  (1 unrouted)
6  (1 unrouted)
7  (1 unrouted)
8  (1 unrouted)
9  (1 unrouted)
10  (1 unrouted)
11  (1 unrouted)
12  (1 unrouted)
13  (2 unrouted)
22  (1 unrouted)
23  (1 unrouted)
24  (1 unrouted)
25  (1 unrouted)
26  (1 unrouted)
27  (1 unrouted)
28  (1 unrouted)
29  (1 unrouted)
30  (1 unrouted)
31  (1 unrouted)
32  (1 unrouted)
33  (1 unrouted)
34  (1 unrouted)
35  (1 unrouted)
36  (1 unrouted)
37  (4 unrouted)
38  (1 unrouted)
39  (1 unrouted)
40  (2 unrouted)
41  (1 unrouted)
42  (1 unrouted)
43  (1 unrouted)
44  (1 unrouted)
45  (1 unrouted)
46  (1 unrouted)
47  (1 unrouted)
48  (1 unrouted)
49  (1 unrouted)
50  (2 unrouted)
51  (2 unrouted)
52  (2 unrouted)
+3.3V  (1 unrouted)
+3V3  (2 unrouted)
+5V  (39 unrouted)
A0  (1 unrouted)
A1  (1 unrouted)
A2  (1 unrouted)
A3  (1 unrouted)
A4  (1 unrouted)
A5  (1 unrouted)
A6  (1 unrouted)
A7  (1 unrouted)
A8  (1 unrouted)
A9  (1 unrouted)
A10  (1 unrouted)
AREF  (1 unrouted)
CMP  (3 unrouted)
D+  (3 unrouted)
D-  (3 unrouted)
DTR  (2 unrouted)
GATE_CMD  (1 unrouted)
GND  (37 unrouted)
  pour Bottom: 0,68.58 0,2.54 2.54,0 107.95,0 110.49,2.54 110.49,53.34 107.95,55.88 101.6,55.88 99.06,58.42 99.06,77.47 96.52,80.01 26.67,80.01 25.4,78.74 25.4,73.66 22.86,71.12 2.54,71.12
HIGH_AMP_5V
  pour Top: 2.54,0 0,2.54 0,68.58 2.54,71.12 22.86,71.12 25.4,73.66 25.4,78.74 26.67,80.01 96.52,80.01 99.06,77.47 99.06,58.42 101.6,55.88 107.95,55.88 110.49,53.34 110.49,2.54 107.95,0
M8RXD  (1 unrouted)
M8TXD  (1 unrouted)
N$11  (1 unrouted)
N$15  (1 unrouted)
N$16  (1 unrouted)
N$17  (1 unrouted)
N$18  (1 unrouted)
N$19  (1 unrouted)
N$20  (1 unrouted)
N$21  (1 unrouted)
N$22  (1 unrouted)
N$23  (1 unrouted)
N$24  (1 unrouted)
N$25  (1 unrouted)
N$26  (1 unrouted)
N$28  (1 unrouted)
N$29  (1 unrouted)
N$30  (1 unrouted)
N$32  (1 unrouted)
N$33  (1 unrouted)
N$42  (1 unrouted)
N$54  (1 unrouted)
N$55  (1 unrouted)
PWRIN  (1 unrouted)
RD+  (1 unrouted)
RD-  (1 unrouted)
RESET  (7 unrouted)
RESET2  (1 unrouted)
RX0  (1 unrouted)
RXL  (1 unrouted)
TX0  (1 unrouted)
TXL  (1 unrouted)
UGND  (5 unrouted)
USBVCC  (3 unrouted)
USHIELD  (6 unrouted)
VUCAP  (1 unrouted)
XT1R  (1 unrouted)
XTAL1  (7 unrouted)
XTAL1R  (1 unrouted)
XTAL2  (7 unrouted)
XVCC  (2 unrouted)

### Text on the board
tNames: GND | 5V | P | Status | P | L | REV 3.0 8/19/2021 | PROSPECT LABS